# EAGLE design Uhr3r4_1 (EAGLE 7.6.0)
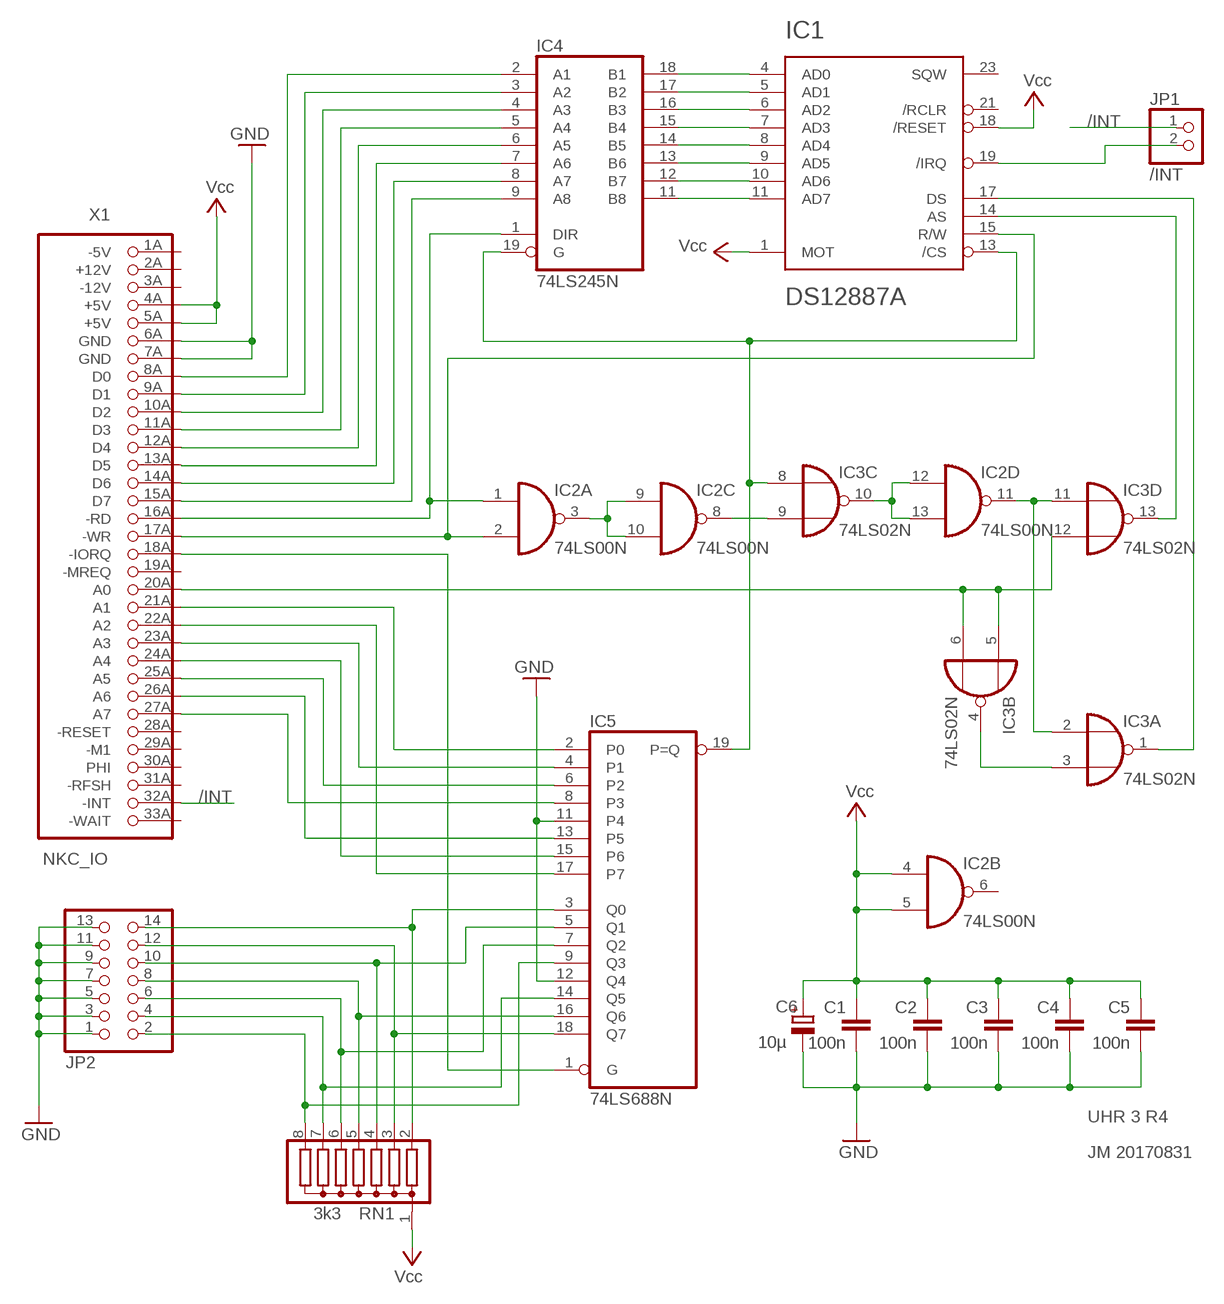
[diagram p0: schematic, sheet 1]

## Parts
C1  100n  C-EU025-025X050  [C025-025X050]
C2  100n  C-EU025-025X050  [C025-025X050]
C3  100n  C-EU025-025X050  [C025-025X050]
C4  100n  C-EU025-025X050  [C025-025X050]
C5  100n  C-EU025-025X050  [C025-025X050]
C6  10µ  CPOL-EUE2.5-5  [E2,5-5]
IC1  DS12887A  [DIL24-6_DS]
IC2  74LS00N  [DIL14]
IC3  74LS02N  [DIL14]
IC4  74LS245N  [DIL20]
IC5  74LS688N  [DIL20]
JP1  /INT  PINHD-1X2  [1X02]
JP2  PINHD-2X7  [2X07]
RN1  3k3  G07R  [SIL8]
X1  NKC_IO  [1X33/90_PCB]

## Nets
/INT: JP1.1 X1.32A(-INT)
GND [supp]: C1.1 C2.1 C3.1 C4.1 C5.1 C6.- IC5.11(P4) IC5.12(Q4) JP2.1 JP2.3 JP2.5 JP2.7 JP2.9 JP2.11 JP2.13 X1.6A(GND) X1.7A(GND)
N$1: IC4.2(A1) X1.8A(D0)
N$2: IC4.3(A2) X1.9A(D1)
N$3: IC4.4(A3) X1.10A(D2)
N$4: IC4.5(A4) X1.11A(D3)
N$5: IC4.6(A5) X1.12A(D4)
N$6: IC4.7(A6) X1.13A(D5)
N$7: IC4.8(A7) X1.14A(D6)
N$8: IC4.9(A8) X1.15A(D7)
N$9: IC1.4(AD0) IC4.18(B1)
N$10: IC1.5(AD1) IC4.17(B2)
N$11: IC1.6(AD2) IC4.16(B3)
N$12: IC1.7(AD3) IC4.15(B4)
N$13: IC1.8(AD4) IC4.14(B5)
N$14: IC1.9(AD5) IC4.13(B6)
N$15: IC1.10(AD6) IC4.12(B7)
N$16: IC1.11(AD7) IC4.11(B8)
N$17: IC1.15(R/W) IC2.2(A:I1) X1.17A(-WR)
N$18: IC5.3(Q0) JP2.14 RN1.2
N$19: IC5.18(Q7) JP2.12 RN1.3
N$20: IC5.5(Q1) JP2.10 RN1.4
N$21: IC5.16(Q6) JP2.8 RN1.5
N$22: IC5.7(Q2) JP2.6 RN1.6
N$23: IC5.14(Q5) JP2.4 RN1.7
N$24: IC5.9(Q3) JP2.2 RN1.8
N$25: IC5.2(P0) X1.21A(A1)
N$26: IC5.17(P7) X1.22A(A2)
N$27: IC5.4(P1) X1.23A(A3)
N$28: IC5.15(P6) X1.24A(A4)
N$29: IC5.6(P2) X1.25A(A5)
N$30: IC5.13(P5) X1.26A(A6)
N$31: IC5.8(P3) X1.27A(A7)
N$32: IC2.1(A:I0) IC4.1(DIR) X1.16A(-RD)
N$33: IC1.19(/IRQ) JP1.2
N$34: IC2.3(A:O) IC2.9(C:I0) IC2.10(C:I1)
N$35: IC2.8(C:O) IC3.9(C:I1)
N$36: IC1.13(/CS) IC3.8(C:I0) IC4.19(G) IC5.19(P=Q)
N$37: IC2.12(D:I0) IC2.13(D:I1) IC3.10(C:O)
N$38: IC3.5(B:I0) IC3.6(B:I1) IC3.12(D:I1) X1.20A(A0)
N$39: IC2.11(D:O) IC3.2(A:I0) IC3.11(D:I0)
N$40: IC3.3(A:I1) IC3.4(B:O)
N$42: IC1.14(AS) IC3.13(D:O)
N$43: IC1.17(DS) IC3.1(A:O)
N$45: IC5.1(G) X1.18A(-IORQ)
VCC [supp]: C1.2 C2.2 C3.2 C4.2 C5.2 C6.+ IC1.1(MOT) IC1.18(/RESET) IC2.4(B:I0) IC2.5(B:I1) RN1.1 X1.4A(+5V) X1.5A(+5V) ; supply symbol labelled Vcc
Unconnected: IC1.21(/RCLR) IC1.23(SQW) IC2.6(B:O) X1.19A(-MREQ) X1.28A(-RESET) X1.29A(-M1) X1.30A(PHI) X1.31A(-RFSH) X1.33A(-WAIT)

## Notes on the sheet
- UHR 3 R4
- JM 20170831

## Power pins joined to a net without a drawn wire
+12V: X1.2A(+12V)
-5V: X1.1A(-5V)
-12V: X1.3A(-12V)
GND: IC1.12(GND) IC2.7(P:GND) IC3.7(P:GND) IC4.10(GND) IC5.10(GND)
VCC: IC1.24(VCC) IC2.14(P:VCC) IC3.14(P:VCC) IC4.20(VCC) IC5.20(VCC)

## Library data of the parts
C1-C5 = rcl:C-EU: CAPACITOR, European symbol
C6 = resistor:CPOL-EU: POLARIZED CAPACITOR, European symbol
IC1 = $eigene:DS12887A
IC2 = 74xx-eu:74*00: Quad 2-input NAND gate
IC3 = 74xx-eu:74*02: Quad 2-input NOR gate
IC4 = 74xx-eu:74*245: Octal BUS TRANSCEIVER, 3-state
IC5 = 74xx-eu:74*688: 8-bit MAGNITUDE/IDENTITY COMPARATOR, totem pole
JP1 = pinhead:PINHD-1X2: PIN HEADER
JP2 = pinhead:PINHD-2X7: PIN HEADER
RN1 = resistor-sil:G07R: SIL RESISTOR; OC_FARNELL: unknown; OC_NEWARK: unknown
X1 = $eigene:NKC_IO

## Net classes
0 default: width 0.406 mm
1 supp: width 0.406 mm

## Board
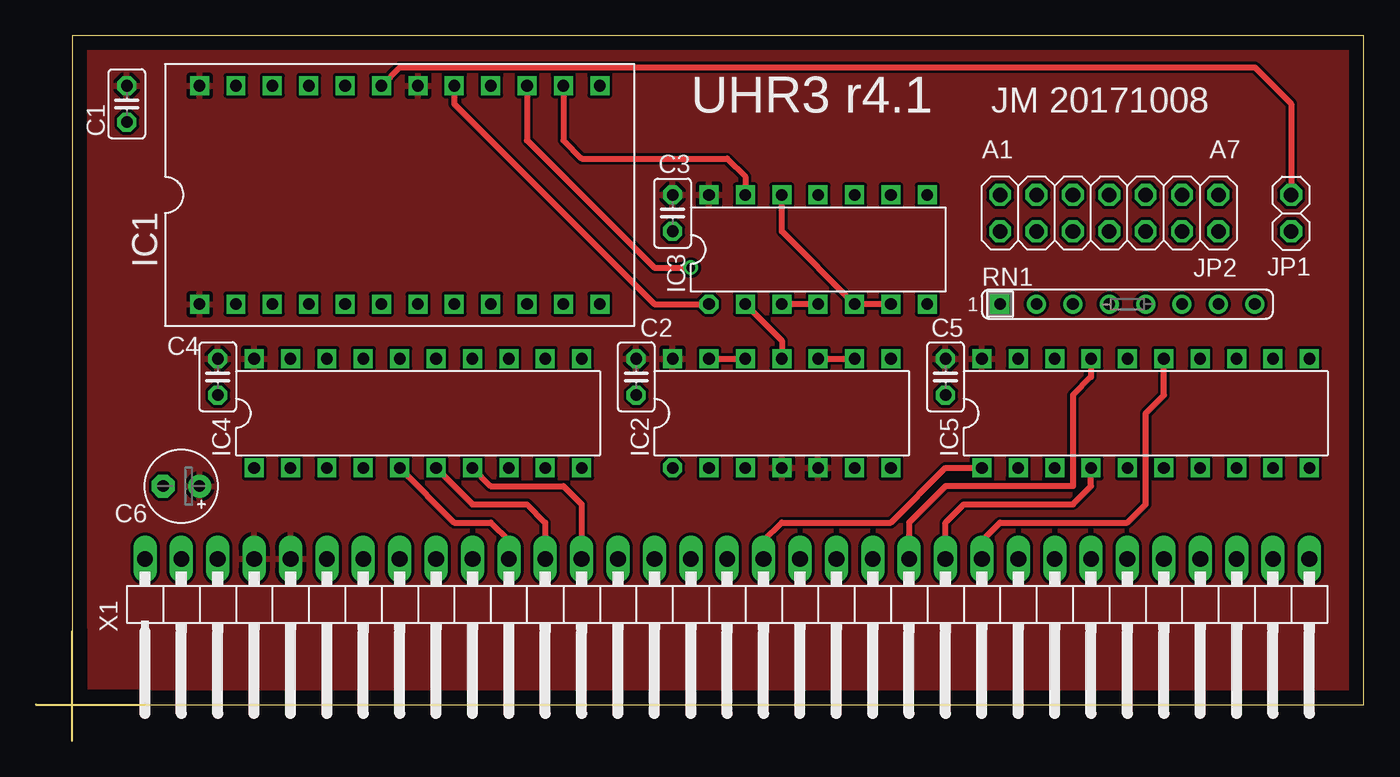
[diagram p1: board, top side]
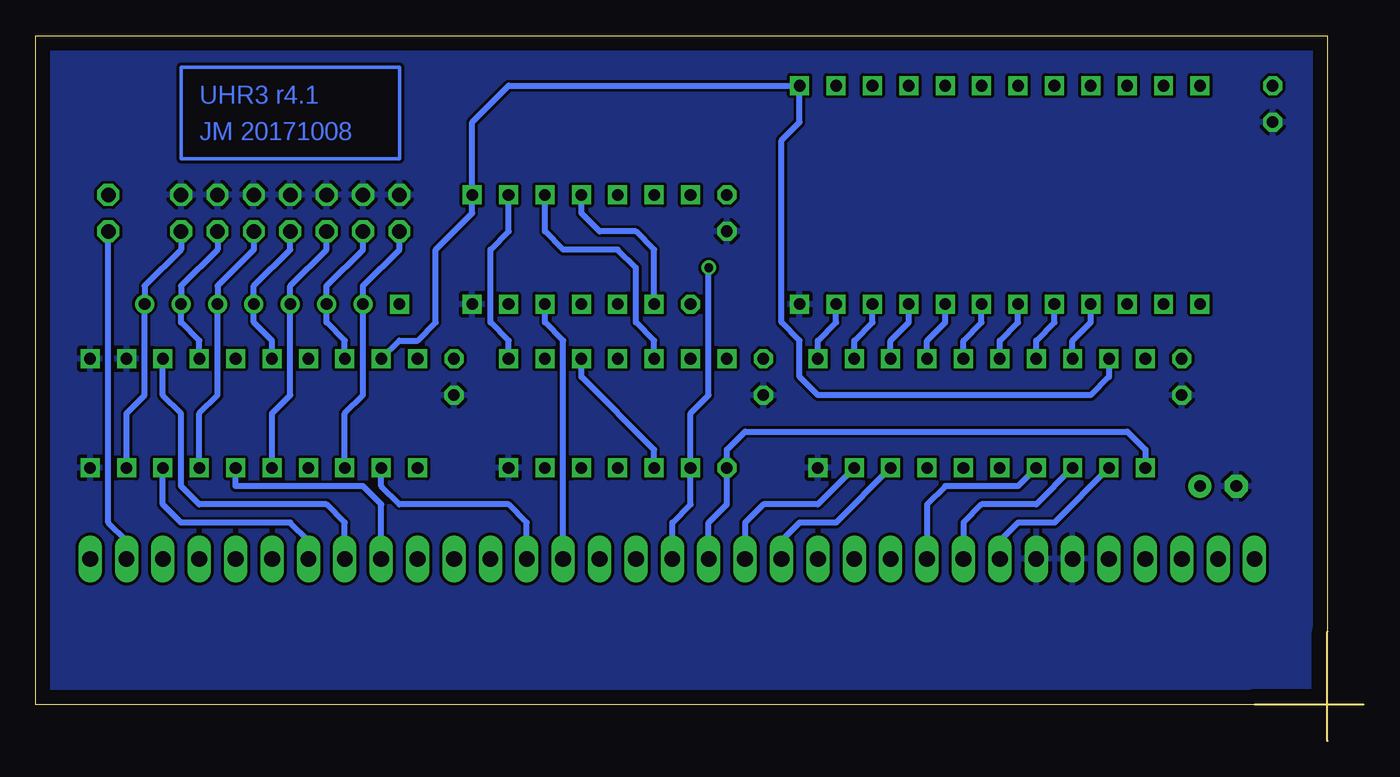
[diagram p2: board, bottom side, seen from below]

Size 90.15 x 46.66 mm. Coordinates in mm from the lower left corner, seen from the top.
Outline: 0,0 90.15,0 90.15,46.66 0,46.66 0,0
Copper layers (1*16): Top 0.035mm / dielectric 1.5mm / Bottom 0.035mm
Design rules "default": minimum track width 10mil, minimum drill 24mil, track to track 8mil, track to pad 8mil, pad to pad 8mil, via to via 8mil, smd to smd 8mil, copper to edge 40mil, drill to drill 8mil, minimum pad ring 10mil, minimum via ring 8mil, stop-mask expansion 4mil, vias tented up to drill 0mil, thermal gap 10mil

### Footprints (pad centres in the part's own frame; a part is rotated, then mirrored left to right if it is on the bottom)
C025-025X050 = drill 0.813 octagon: 1 -1.27,0; 2 1.27,0
E2,5-5 = drill 0.813 pad 1.6: + -1.27,0 | drill 0.813 pad 1.6 octagon: - 1.27,0
DIL24-6_DS = drill 0.813 square: 1 -13.97,-7.62; 2 -11.43,-7.62; 3 -8.89,-7.62; 4 -6.35,-7.62; 5 -3.81,-7.62; 6 -1.27,-7.62; 7 1.27,-7.62; 8 3.81,-7.62; 9 6.35,-7.62; 10 8.89,-7.62; 11 11.43,-7.62; 12 13.97,-7.62; 13 13.97,7.62; 14 11.43,7.62; 15 8.89,7.62; 16 6.35,7.62; 17 3.81,7.62; 18 1.27,7.62; 19 -1.27,7.62; 20 -3.81,7.62; 21 -6.35,7.62; 22 -8.89,7.62; 23 -11.43,7.62; 24 -13.97,7.62
DIL14 = drill 0.813 octagon: 1 -7.62,-3.81 | drill 0.813 square: 2 -5.08,-3.81; 3 -2.54,-3.81; 4 0,-3.81; 5 2.54,-3.81; 6 5.08,-3.81; 7 7.62,-3.81; 8 7.62,3.81; 9 5.08,3.81; 10 2.54,3.81; 11 0,3.81; 12 -2.54,3.81; 13 -5.08,3.81; 14 -7.62,3.81
DIL20 = drill 0.813 square: 1 -11.43,-3.81; 2 -8.89,-3.81; 3 -6.35,-3.81; 4 -3.81,-3.81; 5 -1.27,-3.81; 6 1.27,-3.81; 7 3.81,-3.81; 8 6.35,-3.81; 9 8.89,-3.81; 10 11.43,-3.81; 11 11.43,3.81; 12 8.89,3.81; 13 6.35,3.81; 14 3.81,3.81; 15 1.27,3.81; 16 -1.27,3.81; 17 -3.81,3.81; 18 -6.35,3.81; 19 -8.89,3.81; 20 -11.43,3.81
1X02 = drill 1.016 octagon: 1 -1.27,0; 2 1.27,0
2X07 = drill 1.016 octagon: 1 -7.62,-1.27; 2 -7.62,1.27; 3 -5.08,-1.27; 4 -5.08,1.27; 5 -2.54,-1.27; 6 -2.54,1.27; 7 0,-1.27; 8 0,1.27; 9 2.54,-1.27; 10 2.54,1.27; 11 5.08,-1.27; 12 5.08,1.27; 13 7.62,-1.27; 14 7.62,1.27
SIL8 = drill 0.813 square: 1 -8.89,0 | drill 0.813: 2 -6.35,0; 3 -3.81,0; 4 -1.27,0; 5 1.27,0; 6 3.81,0; 7 6.35,0; 8 8.89,0
1X33/90_PCB = drill 1.1 pad 1.524 long: 1A -38.1,3.81; 2A -35.56,3.81; 3A -33.02,3.81; 4A -30.48,3.81; 5A -27.94,3.81; 6A -25.4,3.81; 7A -22.86,3.81; 8A -20.32,3.81; 9A -17.78,3.81; 10A -15.24,3.81; 11A -12.7,3.81; 12A -10.16,3.81; 13A -7.62,3.81; 14A -5.08,3.81; 15A -2.54,3.81; 16A 0,3.81; 17A 2.54,3.81; 18A 5.08,3.81; 19A 7.62,3.81; 20A 10.16,3.81; 21A 12.7,3.81; 22A 15.24,3.81; 23A 17.78,3.81; 24A 20.32,3.81; 25A 22.86,3.81; 26A 25.4,3.81; 27A 27.94,3.81; 28A 30.48,3.81; 29A 33.02,3.81; 30A 35.56,3.81; 31A 38.1,3.81; 32A 40.64,3.81; 33A 43.18,3.81

### Placement (x,y rotation side)
C1  3.81,41.91 90 top
C2  39.37,22.86 90 top
C3  41.91,34.29 90 top
C4  10.16,22.86 90 top
C5  60.96,22.86 90 top
C6  7.62,15.24 180 top
IC1  22.86,35.56 0 top
IC2  49.53,20.32 0 top
IC3  52.07,31.75 0 top
IC4  24.13,20.32 0 top
IC5  74.93,20.32 0 top
JP1  85.09,34.29 90 top
JP2  72.39,34.29 180 top
RN1  73.66,27.94 0 top
X1  43.18,6.35 0 top

### Tracks (layer width: path | path; a pad name or v marks a point on that pad's centre or on a via)
/INT
  Bottom 0.406: X1.32A 83.82,11.43 85.09,12.7 JP1.1
GND
  pour Bottom: 0,0 90.17,0 90.17,46.99 0,46.99
N$1
  Bottom 0.406: IC4.2 19.05,12.7 21.59,12.7 22.86,11.43 X1.8A
N$2
  Bottom 0.406: IC4.3 20.32,13.97 24.13,13.97 25.4,12.7 X1.9A
N$3
  Bottom 0.406: IC4.4 21.59,15.24 26.67,15.24 27.94,13.97 X1.10A
N$4
  Top 0.406: IC4.5 26.67,12.7 29.21,12.7 30.48,11.43 X1.11A
N$5
  Top 0.406: IC4.6 27.94,13.97 31.75,13.97 33.02,12.7 X1.12A
N$6
  Top 0.406: IC4.7 29.21,15.24 34.29,15.24 35.56,13.97 X1.13A
N$7
  Bottom 0.406: IC4.8 34.29,12.7 36.83,12.7 38.1,11.43 X1.14A
N$8
  Bottom 0.406: IC4.9 35.56,13.97 39.37,13.97 40.64,12.7 X1.15A
N$9
  Bottom 0.406: IC4.18 17.78,25.4 16.51,26.67 IC1.4
N$10
  Bottom 0.406: IC4.17 20.32,25.4 19.05,26.67 IC1.5
N$11
  Bottom 0.406: IC4.16 22.86,25.4 21.59,26.67 IC1.6
N$12
  Bottom 0.406: IC4.15 25.4,25.4 24.13,26.67 IC1.7
N$13
  Bottom 0.406: IC4.14 27.94,25.4 26.67,26.67 IC1.8
N$14
  Bottom 0.406: IC4.13 30.48,25.4 29.21,26.67 IC1.9
N$15
  Bottom 0.406: IC4.12 33.02,25.4 31.75,26.67 IC1.10
N$16
  Bottom 0.406: IC4.11 35.56,25.4 34.29,26.67 IC1.11
N$17  (via drill 0.61)
  Top 0.406: IC1.15 31.75,39.37 40.64,30.48 v43.18,30.48
  Bottom 0.406: X1.17A 45.72,12.7 44.45,13.97 IC2.2 44.45,20.32 43.18,21.59 v43.18,30.48
N$18
  Bottom 0.406: JP2.14 64.77,31.75 67.31,29.21 RN1.2 67.31,21.59 68.58,20.32 IC5.3
N$19
  Bottom 0.406: IC5.18 68.58,25.4 69.85,26.67 RN1.3 69.85,29.21 67.31,31.75 JP2.12
N$20
  Bottom 0.406: IC5.5 73.66,20.32 72.39,21.59 RN1.4 72.39,29.21 69.85,31.75 JP2.10
N$21
  Bottom 0.406: IC5.16 73.66,25.4 74.93,26.67 RN1.5 74.93,29.21 72.39,31.75 JP2.8
N$22
  Bottom 0.406: IC5.7 78.74,20.32 77.47,21.59 RN1.6 77.47,29.21 74.93,31.75 JP2.6
N$23
  Bottom 0.406: IC5.14 78.74,25.4 80.01,26.67 RN1.7 80.01,29.21 77.47,31.75 JP2.4
N$24
  Bottom 0.406: IC5.9 83.82,20.32 82.55,21.59 RN1.8 82.55,29.21 80.01,31.75 JP2.2
N$25
  Bottom 0.406: X1.21A 55.88,12.7 57.15,13.97 64.77,13.97 66.04,15.24 IC5.2
N$26
  Top 0.406: IC5.17 71.12,22.86 69.85,21.59 69.85,15.24 60.96,15.24 58.42,12.7 X1.22A
N$27
  Top 0.406: X1.23A 60.96,12.7 62.23,13.97 69.85,13.97 71.12,15.24 IC5.4
N$28
  Top 0.406: X1.24A 63.5,11.43 64.77,12.7 73.66,12.7 74.93,13.97 74.93,20.32 76.2,21.59 IC5.15
N$29
  Bottom 0.406: X1.25A 66.04,13.97 67.31,15.24 76.2,15.24 IC5.6
N$30
  Bottom 0.406: X1.26A 68.58,12.7 69.85,13.97 78.74,13.97 80.01,15.24 80.01,20.32 81.28,21.59 IC5.13
N$31
  Bottom 0.406: X1.27A 71.12,11.43 72.39,12.7 80.01,12.7 81.28,13.97 IC5.8
N$32
  Bottom 0.406: X1.16A 43.18,12.7 41.91,13.97 IC2.1 41.91,17.78 40.64,19.05 13.97,19.05 12.7,17.78 IC4.1
N$33
  Top 0.406: IC1.19 22.86,44.45 82.55,44.45 85.09,41.91 JP1.2
N$34
  Top 0.406: IC2.10 IC2.9
  Bottom 0.406: IC2.3 46.99,17.78 52.07,22.86 IC2.10
N$35
  Bottom 0.406: IC2.8 57.15,25.4 58.42,26.67 58.42,31.75 57.15,33.02 IC3.9
N$36
  Bottom 0.406: IC5.19 64.77,25.4 63.5,25.4 62.23,26.67 62.23,31.75 59.69,34.29 IC3.8 59.69,40.64 57.15,43.18 IC1.13 36.83,40.64 38.1,39.37 38.1,26.67 36.83,25.4 36.83,22.86 35.56,21.59 16.51,21.59 15.24,22.86 IC4.19
N$37
  Top 0.406: IC2.13 IC2.12
  Bottom 0.406: IC2.12 46.99,25.4 48.26,26.67 48.26,30.48 49.53,31.75 53.34,31.75 54.61,33.02 IC3.10
N$38
  Top 0.406: IC3.6 IC3.5 49.53,33.02 IC3.12
  Bottom 0.406: X1.20A 53.34,25.4 54.61,26.67 IC3.5
N$39
  Top 0.406: IC3.2 49.53,25.4 IC2.11
  Bottom 0.406: IC3.2 46.99,31.75 48.26,33.02 50.8,33.02 52.07,34.29 IC3.11
N$40
  Top 0.406: IC3.4 IC3.3
N$41
  Bottom 0.254: 64.77,44.45 80.01,44.45 80.01,38.1 64.77,38.1 64.77,44.45
N$42
  Top 0.406: IC1.14 34.29,39.37 35.56,38.1 45.72,38.1 46.99,36.83 IC3.13
N$43
  Top 0.406: IC1.17 26.67,41.91 40.64,27.94 IC3.1
N$45
  Top 0.406: X1.18A 48.26,11.43 49.53,12.7 57.15,12.7 60.96,16.51 IC5.1
VCC
  pour Top: 0,0 90.17,0 90.17,46.99 0,46.99

### Text on the board
Bottom: UHR3 r4.1 | JM 20171008
tNames: UHR3 r4.1 | JM 20171008 | A1 | A7